# Altium schematic sheet HDMI_CONNECTOR.SchDoc: HDMI CONNECTOR
size A3; Author: Silvio Navaretti; CompanyName: ARDUINO; DrawnBy: Silvio Navaretti; Engineer: Silvio Navaretti; Organization: ARDUINO; SheetNumber: 46; SheetTotal: 51; RevAuthor: Silvio Navaretti
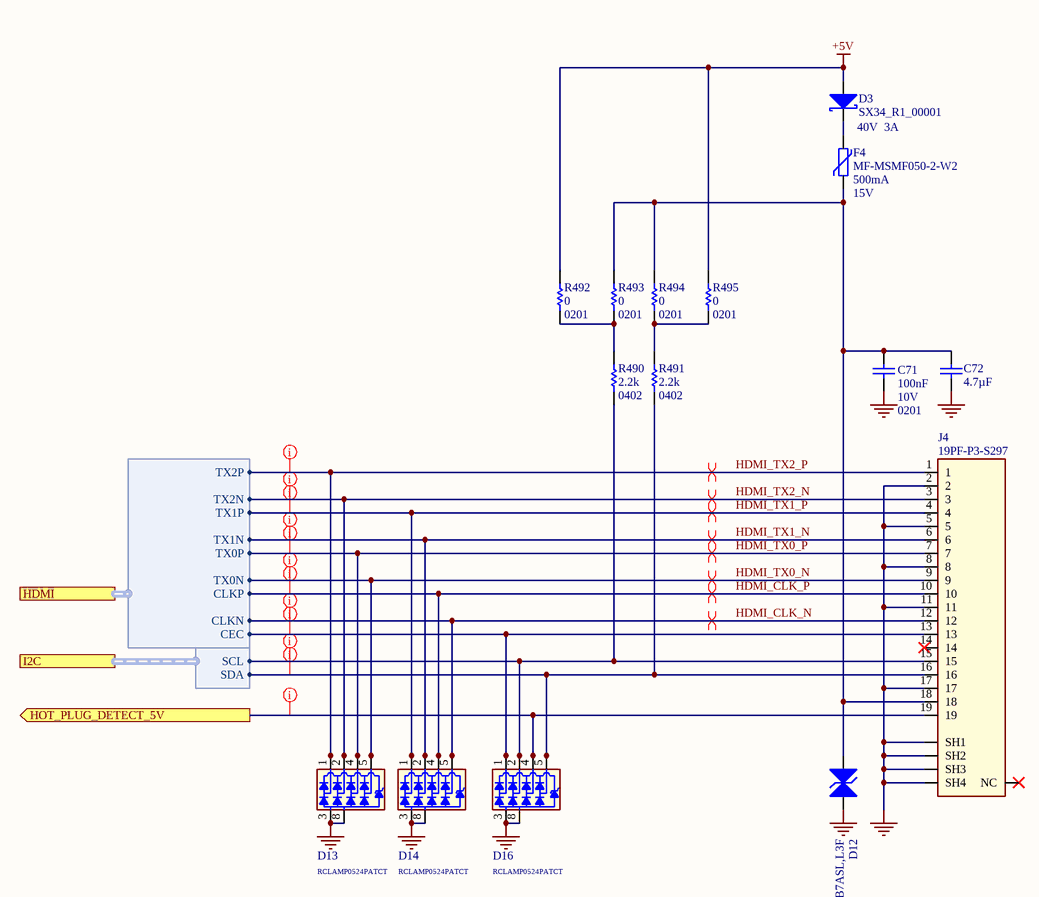
[diagram p0: HDMI_CONNECTOR.SchDoc]

## Parts
C71  value 100nF  Voltage: 10V  Case Code (Imperial): 0201  [CAP-0201]  (hidden comment: CL03A104KP3NNNC)
C72  value 4.7µF  [CAP-0402]  (hidden comment: C1005A475M6R3NT)
D3  SX34_R1_00001  Max Reverse Voltage (DC): 40V  Forward Current: 3A  [SMA DO214AC]
D12  DF2B7ASL,L3F  [DF2B7ASL,L3F]
D13  RCLAMP0524PATCT  [SLP2510P8]
D14  RCLAMP0524PATCT  [SLP2510P8]
D16  RCLAMP0524PATCT  [SLP2510P8]
F4  MF-MSMF050-2-W2  Hold Current: 500mA  Operating Supply Voltage: 15V  [1812]
J4  19PF-P3-S297  [19PF-P3-S297]
R490  value 2.2k  Case Code (Imperial): 0402  [RES-0402]  (hidden comment: AF0402FR-072K2L)
R491  value 2.2k  Case Code (Imperial): 0402  [RES-0402]  (hidden comment: AF0402FR-072K2L)
R492  value 0  Case Code (Imperial): 0201  [RES-0201]  (hidden comment: CRCW02010000Z0ED)
R493  value 0  Case Code (Imperial): 0201  [RES-0201]  (hidden comment: CRCW02010000Z0ED)
R494  value 0  Case Code (Imperial): 0201  [RES-0201]  (hidden comment: CRCW02010000Z0ED)
R495  value 0  Case Code (Imperial): 0201  [RES-0201]  (hidden comment: CRCW02010000Z0ED)

## Ports
HDMI (harness HDMI), HOT_PLUG_DETECT_5V (out), I2C (harness I2C)

## Harnesses
HDMI: TX2P, TX2N, TX1P, TX1N, TX0P, TX0N, CLKP, CLKN, CEC
I2C: SDA, SCL

## Nets
+5V: D3.A R492.2 R495.2
GND: C71.1 C72.1 D12.1(A1) D13.3 D13.8 D14.3 D14.8 D16.3 D16.8 J4.2 J4.5 J4.8 J4.11 J4.17 J4.SH1 J4.SH2 J4.SH3 J4.SH4
HDMI_CLK_N: D14.5 D14.6 J4.12 ; port HDMI.CLKN
HDMI_CLK_P: D14.4 D14.7 J4.10 ; port HDMI.CLKP
HDMI_TX0_N: D13.5 D13.6 J4.9 ; port HDMI.TX0N
HDMI_TX0_P: D13.4 D13.7 J4.7 ; port HDMI.TX0P
HDMI_TX1_N: D14.2 D14.9 J4.6 ; port HDMI.TX1N
HDMI_TX1_P: D14.1 D14.10 J4.4 ; port HDMI.TX1P
HDMI_TX2_N: D13.2 D13.9 J4.3 ; port HDMI.TX2N
HDMI_TX2_P: D13.1 D13.10 J4.1 ; port HDMI.TX2P
HOT_PLUG_DETECT_5V: D16.4 D16.7 J4.19 ; port HOT_PLUG_DETECT_5V
NetC71_2: C71.2 C72.2 D12.2(A2) F4.1 J4.18 R493.2 R494.2
NetD3_C: D3.C F4.2
NetD16_1: D16.1 D16.10 J4.13 ; port HDMI.CEC
NetD16_2: D16.2 D16.9 J4.15 R490.2 ; port I2C.SCL
NetD16_5: D16.5 D16.6 J4.16 R491.2 ; port I2C.SDA
NetR490_1: R490.1 R492.1 R493.1
NetR491_1: R491.1 R494.1 R495.1

Not connected (* = marked no-connect by the designer): J4 14* NC*

## Layout directives
net class NET_HDMI: HDMI_CLK_N, HDMI_CLK_P, HDMI_TX0_N, HDMI_TX0_P, HDMI_TX1_N, HDMI_TX1_P, HDMI_TX2_N, HDMI_TX2_P, HOT_PLUG_DETECT_5V, NetD16_1, NetD16_2, NetD16_5
differential pair; differential pair class DIFF_HDMI; net class NET_DIFF_HDMI: HDMI_CLK_N, HDMI_CLK_P, HDMI_TX0_N, HDMI_TX0_P, HDMI_TX1_N, HDMI_TX1_P, HDMI_TX2_N, HDMI_TX2_P

## Notes on the sheet
- Title:
- ID:
- Date:
- Time:
- Version:
- Sheet
- of
- RevAuthor:
- Reference Designs ARE PROVIDED "AS IS" AND "WITH ALL FAULTS. Arduino SA DISCLAIMS ALL OTHER WARRANTIES, EXPRESS OR IMPLIED, REGARDING PRODUCTS, INCLUDING BUT NOT LIMITED TO, ANY IMPLIED WARRANTIES OF MERCHANTABILITY OR FITNESS FOR A PARTICULAR PURPOSE.
  Arduino SA may make changes to specifications and product descriptions at any time, without notice. The Customer must not rely on the absence or characteristics of any features or instructions marked "reserved" or "undefined".
  Arduino SA reserves these for future definition and shall have no responsibility whatsoever for conflicts or incompatibilities arising from future changes to them. The product information on the Web Site or Materials is subject to change without notice.
  Do not finalize a design with this info. ARDUINO and other Arduino brands and logos and Trademarks of Arduino SA. All Arduino SA Trademarks cannot be used without owner's formal permission.
- File:
- Author:

## Library data of the parts
C71 = C0113-A.6: CAP CHIP 0201 100nF 10% 10V X5R; Manufacturer: Samsung Electro-Mechanics; Code Arduino: C0113; Technology: Ceramic; Part Number: CL03A104KP3NNNC; Dielectric: X5R; Tolerance: 10%
C72 = C0037-A.14: CAP CHIP 0402 4.7uF 20% 6V3 X5R; Manufacturer: Hottech; Code Arduino: 0833; Voltage: 6.3V; Dielectric: X5R; Technology: Ceramic; Part Number: C1005A475M6R3NT; Manufacturer 2: Samsung Electro-Mechanics; Case Code (Imperial): 0402; Tolerance: 20%; Manufacturer 3: Murata Electronics; Part number 3: GRM155R60J475ME47D; Part number 2: CL05A475KQ5NRNC
D3 = D0109-A.2: DIODE SCHOTTKY SMD 3A 40V SMA DO214AC; Part Number: SX34-AU_R1_000A1; Manufacturer: Panjit; Code Arduino: D0109; Forward Voltage: 0.39V; Device Type: Diode Schottky
D12 = D0099-5: TVS BIDIRECTIONAL SMD Vr 5.5V, Vbr min 5.8V, 0.62x0.32mm; Manufacturer: TOSHIBA; Vforward max: 0V; Ireverse max: 1µA; Power max: 80W; Code Arduino: D0099; Vreverse max: 20V; V(BR) min: 5.8V; V(RWM) max: 5.5V; Part Number: DF2B7ASL,L3F
D13 D14 D16 = D0097-A.6: TVS UNIDIRECTIONAL 4CH 0.8pF 5V SLP2510P8 10-pin 2.5x1.0x0.58mm; Manufacturer: SEMTECH; Code Arduino: D0097; Device Type: ESD protection; Part Number: RCLAMP0524PATCT
F4 = P0002-A.7: PTC RESET FUSE 15V 500MA 1812 LOGO OO ARDUINO; Manufacturer: Bourns; Approvals: UL,CSA,TUV; Time to Trip: 0.15s; Max Current Rating: 100A; Trip Current: 1A; Resistance: 150mR; Code Arduino: 3335; Power Dissipation: 800mW; Part Number: MF-MSMF050-2-W2; Contact Plating: Gold; Case Code (Metric): 4532; Min Operating Temperature: -40°C; Packaging: Tape and Reel; Max Operating Temperature: 85°C; Radiation Hardening: No; Voltage Rating (DC): 15V; Termination: SMD/SMT; Number of Terminals: 2; Terminal Material: Gold; Voltage Rating: 15V; Width: 3.41mm; Case Code (Imperial): 1812; Length: 4.73mm; Current Rating: 100A; REACH SVHC: No SVHC; Package Quantity: 2000; Lead Free: Lead Free; Case/Package: 1812; Height: 0.85mm; Mount: Surface Mount,PCB
J4 = J0578-A.2: CONN HDMI RIGHT ANGLE FEMALE 19 POSITIONS 7.75x23.06x16.4mm signals pins lengths 2.3mm; Manufacturer: Contact technology; Code Arduino: J0578; Part Number: 19PF-P3-S297
R490 R491 = R0286-A.3: RES CHIP 0402 2k2 1% 1/16W; Manufacturer: Yageo; Power: 62.5mW; Temperature coefficient: 100ppm; Code Arduino: R0286; Part Number 2: RI0402L2201FT; Technology: Thick film; Tolerance: 1%; Part Number: AF0402FR-072K2L; Manufacturer 2: Hottech
R492-R495 = R0140-A.21: RES CHIP 0201 0R; Manufacturer: Vishay; Temperature coefficient: 0ppm; Code Arduino: R0140; Power: 50mW; Tolerance: 0%; Technology: Thick film; Part Number: CRCW02010000Z0ED